# EAGLE design Fuente de +- 15V (EAGLE 9.6.1)
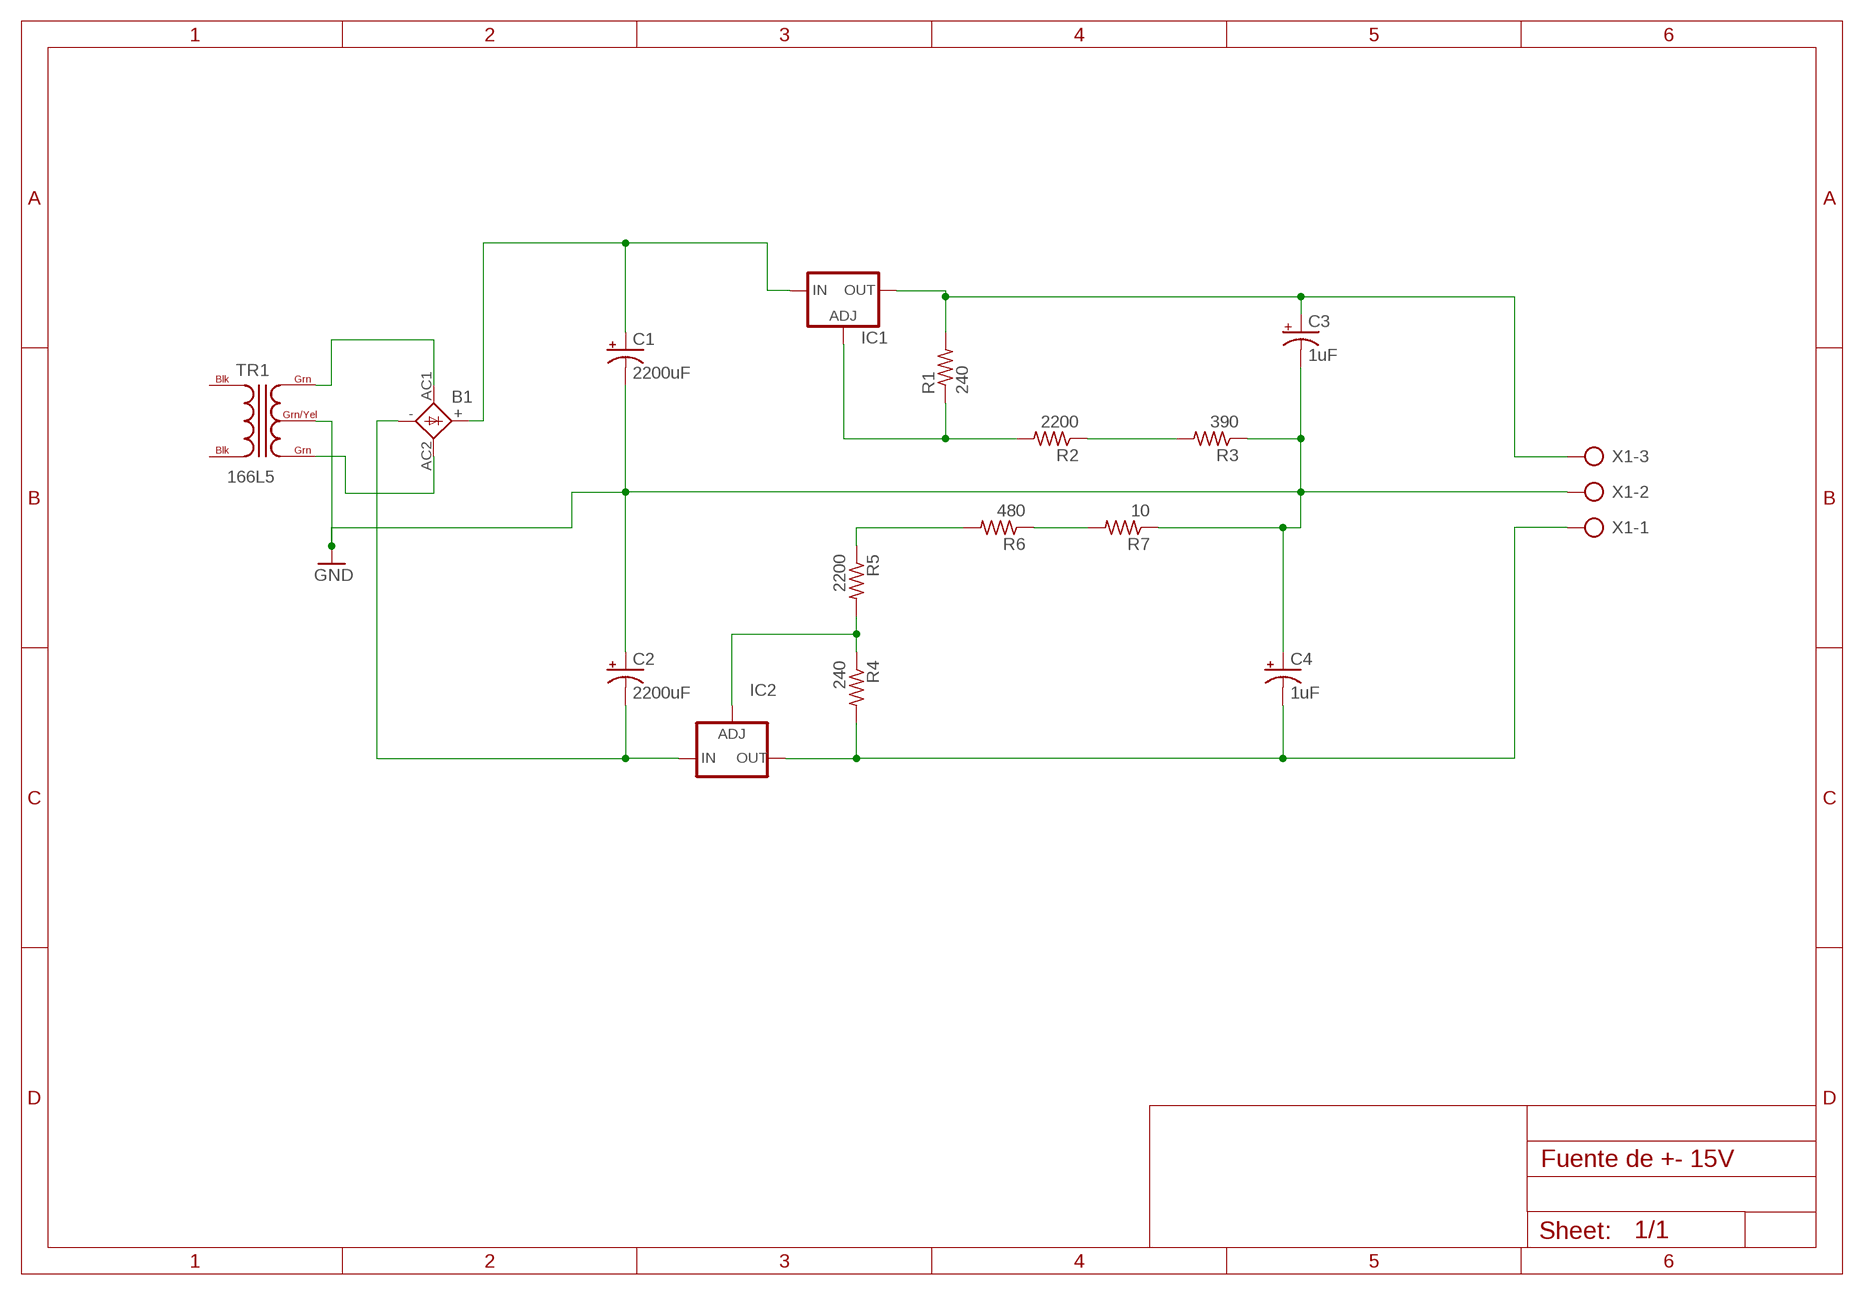
[diagram p0: schematic, sheet 1]

## Parts
B1  2KBP  [2KBP]
C1  2200uF  CPOL-USE7.5-16  [E7,5-16]
C2  2200uF  CPOL-USE7.5-16  [E7,5-16]
C3  1uF  CPOL-USE1.8-4  [E1,8-4]
C4  1uF  CPOL-USE1.8-4  [E1,8-4]
IC1  LM317TS  [317TS]
IC2  LM337TS  [337TS]
R1  240  R-US_0204/7  [0204/7]
R2  2200  R-US_0204/7  [0204/7]
R3  390  R-US_0204/7  [0204/7]
R4  240  R-US_0204/7  [0204/7]
R5  2200  R-US_0204/7  [0204/7]
R6  480  R-US_0204/7  [0204/7]
R7  10  R-US_0204/7  [0204/7]
TR1  166L5  [C7H]
X1  AK300/3  [AK300/3]

## Nets
GND: C1.- C2.+ C3.- C4.+ R3.1 R7.1 TR1.GRN/YEL X1.2
N$1: B1.AC1 TR1.GRN@1(GRN)
N$2: B1.AC2 TR1.GRN@2(GRN)
N$3: B1.+ C1.+ IC1.3(IN)
N$4: C3.+ IC1.2(OUT) R1.2 X1.3
N$5: C4.- IC2.3(OUT) R4.2 X1.1
N$6: IC1.1(ADJ) R1.1 R2.2
N$7: R2.1 R3.2
N$9: B1.- C2.- IC2.2(IN)
N$11: IC2.1(ADJ) R4.1 R5.2
N$12: R5.1 R6.2
N$13: R6.1 R7.2
Unconnected: TR1.BLK@1(BLK) TR1.BLK@2(BLK)

## Library data of the parts
B1 = Componentes_Fuente_15V:2KBP: RECTIFIER grid 3 x 3,81 mm
C1 C2 = rcl:CPOL-US: POLARIZED CAPACITOR, American symbol; SPICEPREFIX: C
C3 C4 = Componentes_Fuente_15V:CPOL-US: POLARIZED CAPACITOR, American symbol; SPICEPREFIX: C
IC1 = Componentes_Fuente_15V:LM317TS: VOLTAGE REGULATOR
IC2 = Componentes_Fuente_15V:LM337TS: VOLTAGE REGULATOR
R1-R7 = Componentes_Fuente_15V:R-US_: RESISTOR, American symbol; SPICEPREFIX: R
TR1 = Componentes_Fuente_15V:166: OPEN STYLE FILAMENT & L.V. RECTIFIER USE TRANSFORMERS Economical single primnary 115VAC, 60 Hz or 117 VAC 50/60 Hz Source: Data sheet <http://www.hammondmfg.com/166.htm>
X1 = Componentes_Filtros:AK300/3: CONNECTOR; OC_FARNELL: unknown; OC_NEWARK: unknown

## Board
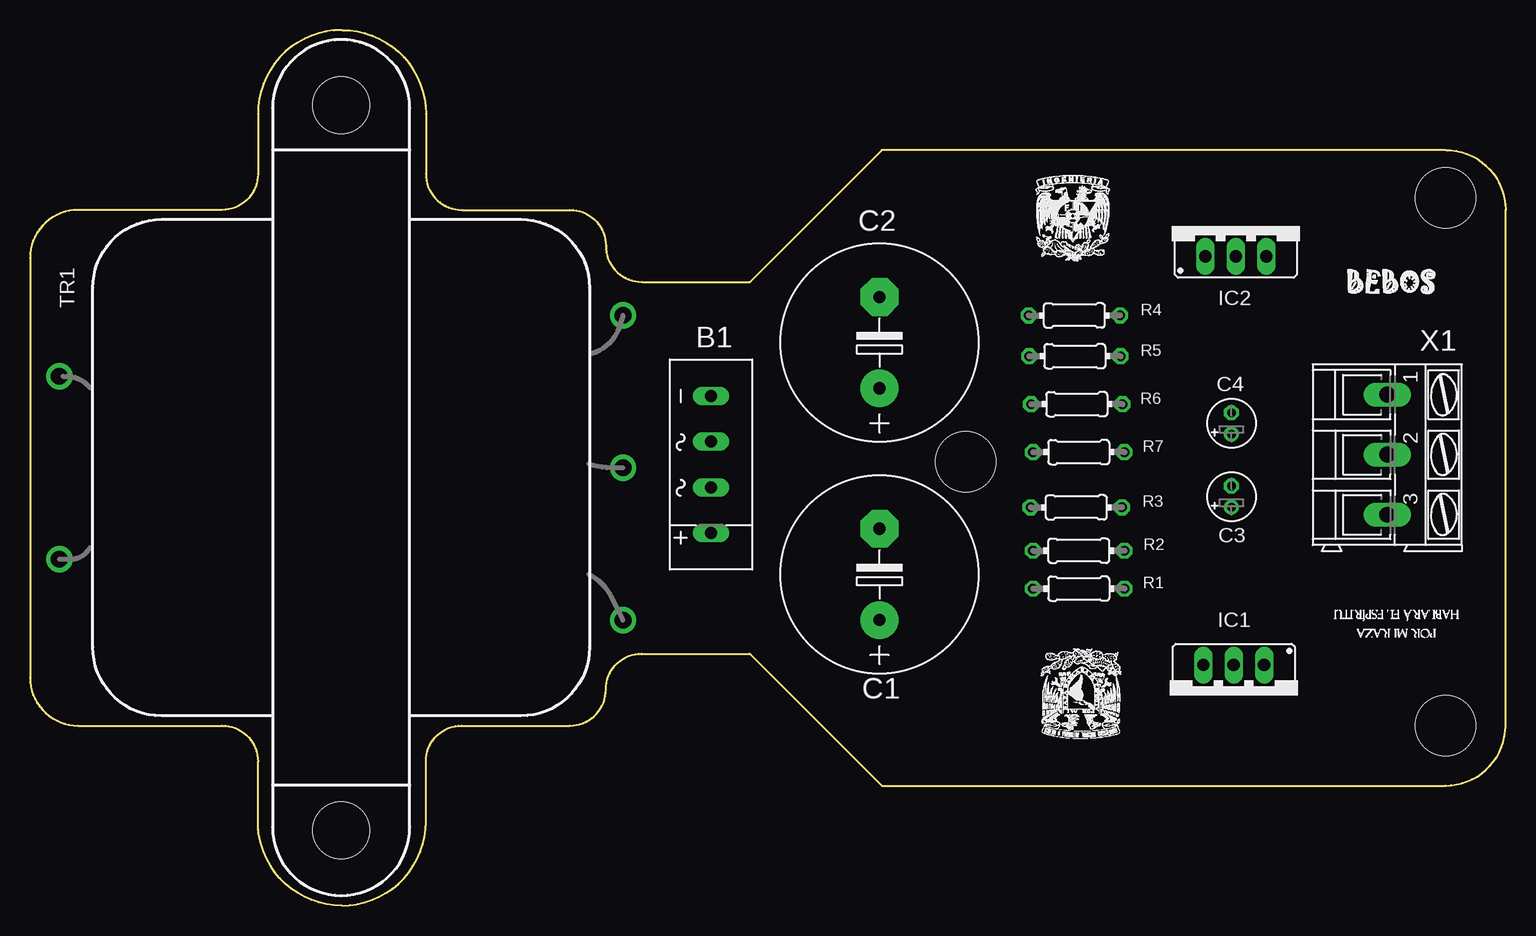
[diagram p1: board, top side]
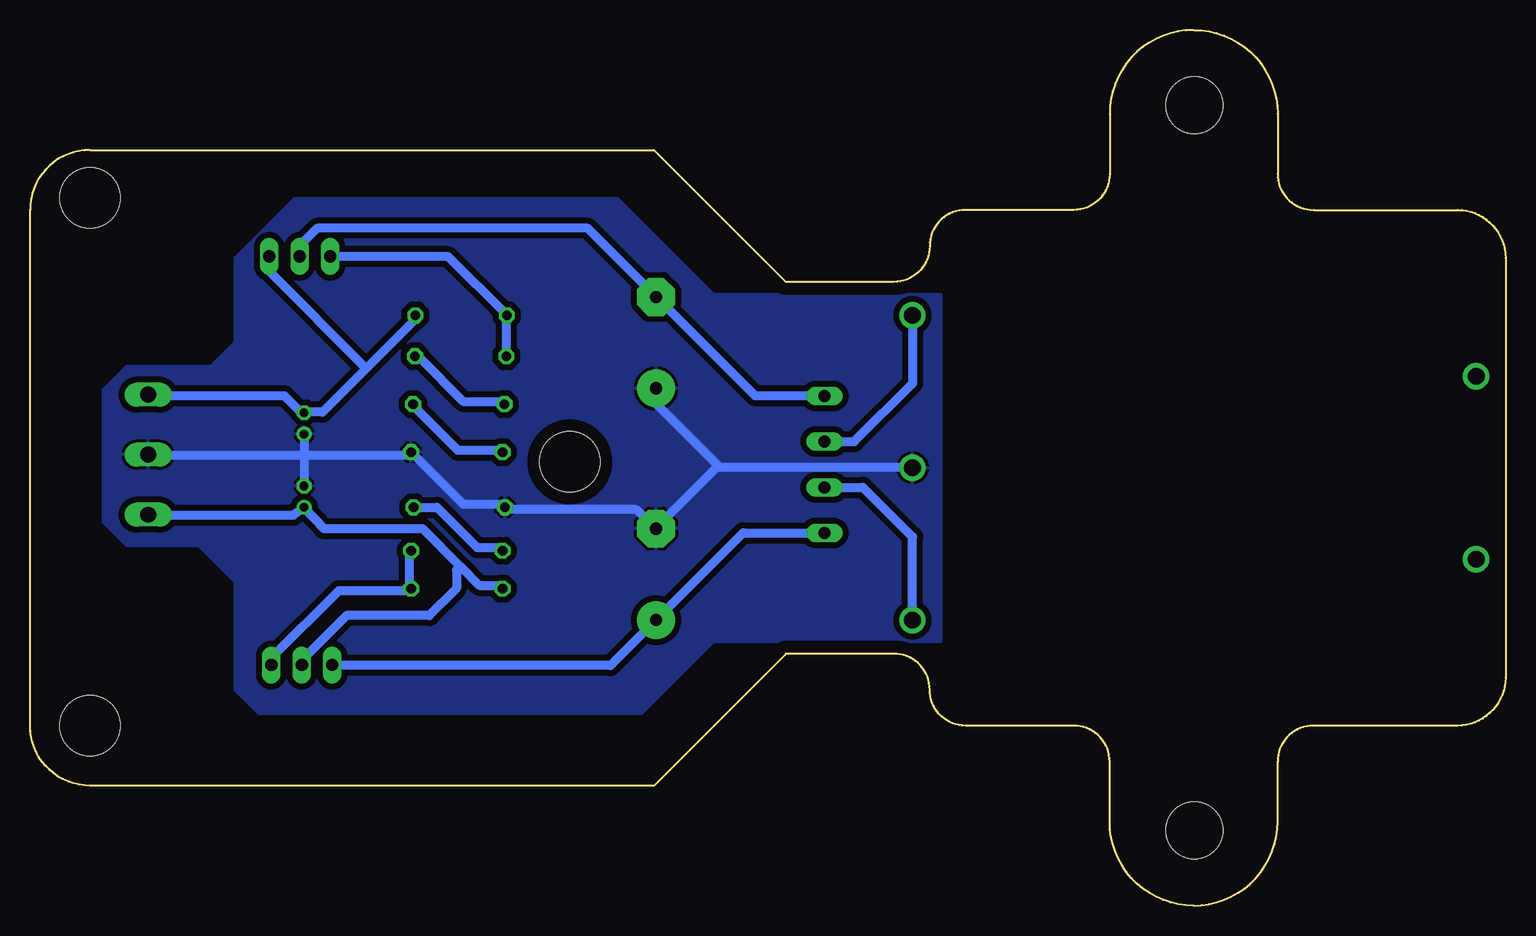
[diagram p2: board, bottom side, seen from below]

Size 123 x 73 mm. Coordinates in mm from the lower left corner, seen from the top.
Outline: 26,73 arc90 19,66 19,61 arc-90 16,58 4,58 arc90 0,54 0,19 arc90 4,15 16,15 arc-90 19,12 19,7 arc90 26,0 arc90 33,7 33,12 arc-90 36,15 45,15 arc90 48,18 arc-90 51,21 60,21 71,10 118,10 arc90 123,15 123,58 arc90 118,63 71,63 60,52 51,52 arc-90 48,55 arc90 45,58 36,58 arc-90 33,61 33,66 arc90 26,73
Copper layers (1*16): Top 0.035mm / dielectric 1.5mm / Bottom 0.035mm
Design rules "default *": minimum track width 0.75mm, minimum drill 0.35mm, track to track 6mil, track to pad 6mil, pad to pad 6mil, via to via 6mil, smd to smd 6mil, copper to edge 40mil, drill to drill 6mil, minimum pad ring 10mil, minimum via ring 8mil, stop-mask expansion 4mil, vias tented up to drill 0mil, thermal gap 10mil
Holes 5 mm at 118,59 118,15 78,37

### Footprints (pad centres in the part's own frame; a part is rotated, then mirrored left to right if it is on the bottom)
2KBP = drill 1.016 long: + 5.715,0; - -5.715,0; AC1 -1.905,0; AC2 1.905,0
E7,5-16 = drill 1.016 pad 3.15: + -3.81,0 | drill 1.016 pad 3.15 octagon: - 3.81,0
E1,8-4 = drill 0.711 pad 1.168: + -0.889,0 | drill 0.711 pad 1.168 octagon: - 0.889,0
317TS = drill 1.016 long: 1 -2.54,-2.54; 2 0,-2.54; 3 2.54,-2.54
337TS = drill 1.016 long: 1 -2.54,-2.54; 2 0,-2.54; 3 2.54,-2.54
0204/7 = drill 0.813 octagon: 1 -3.81,0; 2 3.81,0
C7H = drill 1.4 pad 2.2: BLK@1 -7.62,-23.495; BLK@2 7.62,-23.495; GRN/YEL 0,23.495; GRN@1 -12.7,23.495; GRN@2 12.7,23.495 | hole 4.75: 30.226,0; -30.226,0
AK300/3 = drill 1.321 long: 1 -5.004,0; 2 0,0; 3 5.004,0

### Placement (x,y rotation side)
B1  56.77,36.77 270 top
C1  70.82,27.61 90 top
C2  70.82,46.93 90 top
C3  100.15,34.09 90 top
C4  100.15,40.2 90 top
IC1  100.34,17.51 180 top
IC2  100.52,56.66 0 top
R1  87.42,26.42 180 top
R2  87.42,29.58 0 top
R3  87.22,33.2 0 top
R4  87.06,49.2 0 top
R5  87.1,45.8 180 top
R6  87.26,41.8 180 top
R7  87.42,37.8 180 top
TR1  25.94,36.5 270 top
X1  113.15,37.59 270 top

### Tracks (layer width: path | path; a pad name or v marks a point on that pad's centre or on a via)
GND
  Bottom 0.75: 100.16,37.52 100.16,39.29 C4.+ | C3.- 100.14,37.52 100.16,37.52 | 100.16,37.52 91.4,37.52 R7.1 90.95,37.52 86.89,33.46 83.73,33.46 R3.1 83.28,33.01 72.45,33.01 71.09,31.66 C1.- 70.64,31.66 65.74,36.56 | 100.16,37.52 100.42,37.52 113.06,37.52 X1.2 | TR1.GRN/YEL 49.49,36.56 65.74,36.56 | 65.74,36.56 65.63,36.67 70.87,41.91 70.87,43.07 C2.+
  pour Bottom (isolate 0.5): 48,51 66,51 70,55 74,59 97,59 101,59 106,54 106,47 108,45 115,45 116,44 117,43 117,41 117,32 115,30 109,30 106,27 106,24 106,18 104,16 72,16 66,22 56,22 47,22 47,51
N$1
  Bottom 0.75: B1.AC1 54.3,38.67 49.44,43.53 49.44,48.8 TR1.GRN@1
N$2
  Bottom 0.75: B1.AC2 53.56,34.87 49.44,30.74 49.44,23.99 TR1.GRN@2
N$3
  Bottom 0.75: B1.+ 56.8,31.08 63.55,31.08 70.64,23.99 C1.+ 71.09,23.53 74.61,20.02 97.76,20.02 97.77,20.02 IC1.3
N$4
  Bottom 0.75: X1.3 113.12,32.56 101.06,32.56 C3.+ 98.49,31.42 90.29,31.42 87.13,28.26 87.44,27.95 | R1.2 83.73,26.69 85.55,26.69 87.12,28.26 87.44,27.95 | 87.44,27.95 87.45,27.94 87.45,26.45 89.71,24.19 96.61,24.19 100.33,20.47 100.33,20.06 IC1.2
N$5
  Bottom 0.75: 94.96,44.79 90.95,48.8 R4.2 | 94.96,44.79 98.62,41.13 99.97,41.13 C4.- 100.42,41.13 101.78,42.48 113.06,42.48 X1.1 | IC2.3 103.06,52.89 94.96,44.79
N$6
  Bottom 0.75: R2.2 91.4,29.4 91.4,26.69 R1.1 91.4,26.24 97.27,26.24 102.88,20.63 IC1.1
N$7
  Bottom 0.75: R3.2 89.07,33.2 85.72,29.85 83.73,29.85 R2.1
N$9
  Bottom 0.75: B1.- 56.79,42.51 62.55,42.51 70.64,50.61 C2.- 71.09,51.06 76.51,56.47 99.06,56.47 100.42,55.11 100.42,54.22 IC2.2
N$11
  Bottom 0.75: R5.2 83.28,46.09 83.28,48.8 R4.1 83.28,49.25 88.13,54.1 97.97,54.1 IC2.1
N$12
  Bottom 0.75: R6.2 83.73,42.03 86.89,42.03 90.5,45.64 R5.1
N$13
  Bottom 0.75: R7.2 83.73,37.97 87.34,37.97 90.95,41.58 R6.1